# EAGLE design controller board 1.1 (EAGLE 7.6.0)
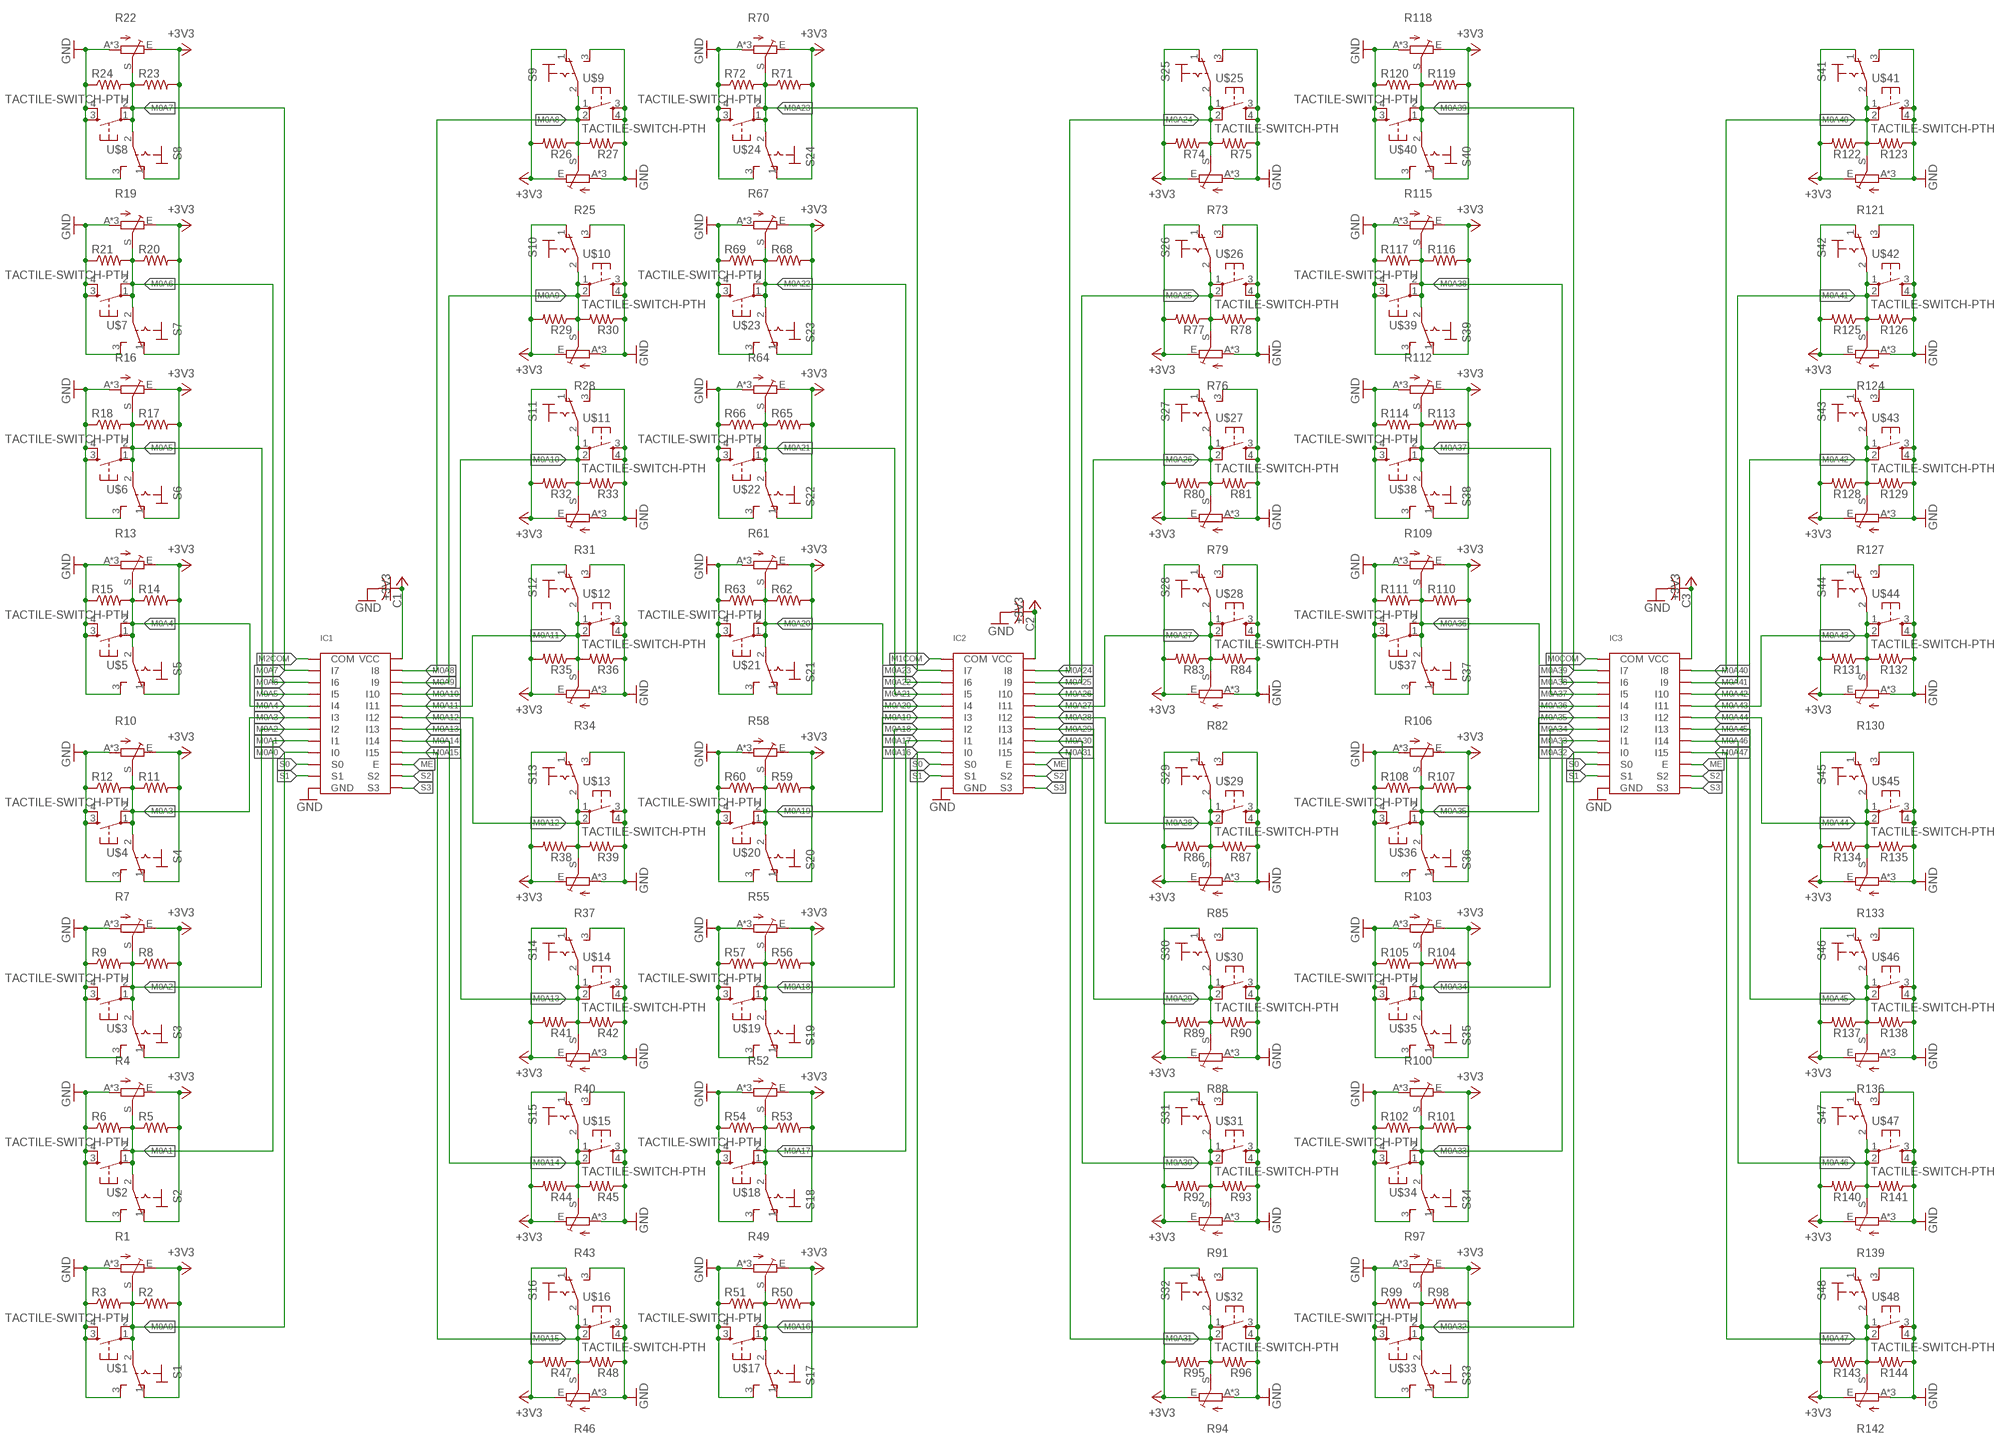
[diagram p0: schematic, sheet 1, part 1 of 2]
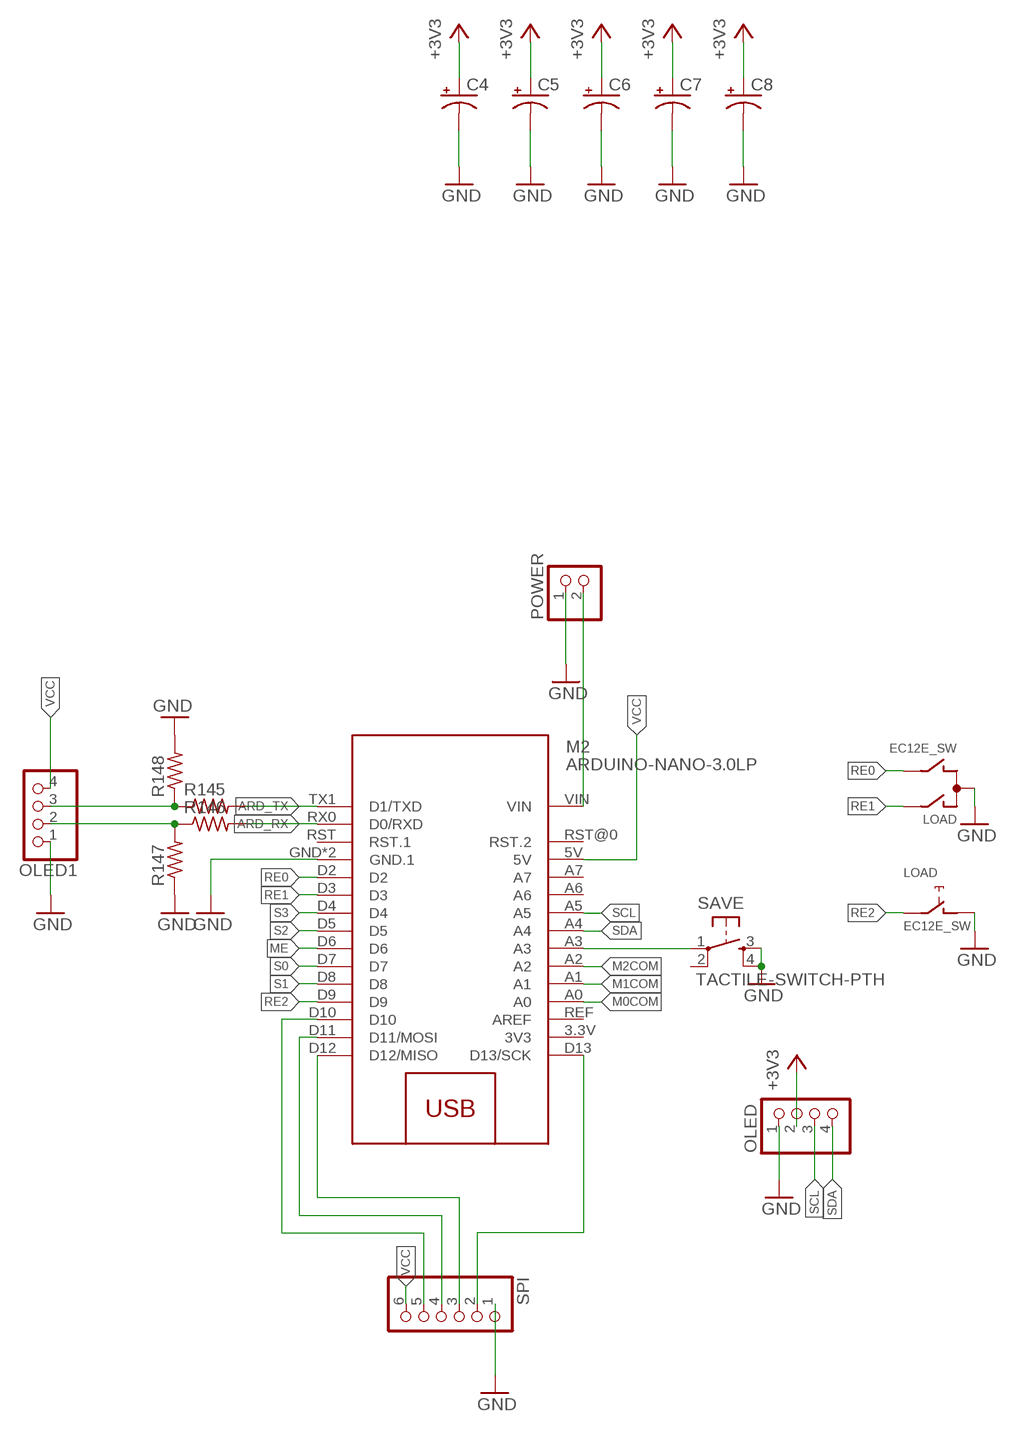
[diagram p1: schematic, sheet 1, part 2 of 2]

## Parts
C1  C-USC0805  [C0805]
C2  C-USC0805  [C0805]
C3  C-USC0805  [C0805]
C4  CPOL-USE2.5-6  [E2,5-6]
C5  CPOL-USE2.5-6  [E2,5-6]
C6  CPOL-USE2.5-6  [E2,5-6]
C7  CPOL-USE2.5-6  [E2,5-6]
C8  CPOL-USE2.5-6  [E2,5-6]
IC1  CD74HC4067SM96  [LP24SSOP]
IC2  CD74HC4067SM96  [LP24SSOP]
IC3  CD74HC4067SM96  [LP24SSOP]
LOAD  EC12E_SW  [ALPS_EC12E_SW]
M2  ARDUINO-NANO-3.0LP  [ARDUINO-NANO-3.0_LONGPADS]
OLED  PINHD-1X4  [1X04]
OLED1  PINHD-1X4  [1X04]
POWER  PINHD-1X2  [1X02]
R1  TDS3_TRIM_EU-RK09LS  [TDS3_RK09L]
R2  R-US_M0805  [M0805]
R3  R-US_M0805  [M0805]
R4  TDS3_TRIM_EU-RK09LS  [TDS3_RK09L]
R5  R-US_M0805  [M0805]
R6  R-US_M0805  [M0805]
R7  TDS3_TRIM_EU-RK09LS  [TDS3_RK09L]
R8  R-US_M0805  [M0805]
R9  R-US_M0805  [M0805]
R10  TDS3_TRIM_EU-RK09LS  [TDS3_RK09L]
R11  R-US_M0805  [M0805]
R12  R-US_M0805  [M0805]
R13  TDS3_TRIM_EU-RK09LS  [TDS3_RK09L]
R14  R-US_M0805  [M0805]
R15  R-US_M0805  [M0805]
R16  TDS3_TRIM_EU-RK09LS  [TDS3_RK09L]
R17  R-US_M0805  [M0805]
R18  R-US_M0805  [M0805]
R19  TDS3_TRIM_EU-RK09LS  [TDS3_RK09L]
R20  R-US_M0805  [M0805]
R21  R-US_M0805  [M0805]
R22  TDS3_TRIM_EU-RK09LS  [TDS3_RK09L]
R23  R-US_M0805  [M0805]
R24  R-US_M0805  [M0805]
R25  TDS3_TRIM_EU-RK09LS  [TDS3_RK09L]
R26  R-US_M0805  [M0805]
R27  R-US_M0805  [M0805]
R28  TDS3_TRIM_EU-RK09LS  [TDS3_RK09L]
R29  R-US_M0805  [M0805]
R30  R-US_M0805  [M0805]
R31  TDS3_TRIM_EU-RK09LS  [TDS3_RK09L]
R32  R-US_M0805  [M0805]
R33  R-US_M0805  [M0805]
R34  TDS3_TRIM_EU-RK09LS  [TDS3_RK09L]
R35  R-US_M0805  [M0805]
R36  R-US_M0805  [M0805]
R37  TDS3_TRIM_EU-RK09LS  [TDS3_RK09L]
R38  R-US_M0805  [M0805]
R39  R-US_M0805  [M0805]
R40  TDS3_TRIM_EU-RK09LS  [TDS3_RK09L]
R41  R-US_M0805  [M0805]
R42  R-US_M0805  [M0805]
R43  TDS3_TRIM_EU-RK09LS  [TDS3_RK09L]
R44  R-US_M0805  [M0805]
R45  R-US_M0805  [M0805]
R46  TDS3_TRIM_EU-RK09LS  [TDS3_RK09L]
R47  R-US_M0805  [M0805]
R48  R-US_M0805  [M0805]
R49  TDS3_TRIM_EU-RK09LS  [TDS3_RK09L]
R50  R-US_M0805  [M0805]
R51  R-US_M0805  [M0805]
R52  TDS3_TRIM_EU-RK09LS  [TDS3_RK09L]
R53  R-US_M0805  [M0805]
R54  R-US_M0805  [M0805]
R55  TDS3_TRIM_EU-RK09LS  [TDS3_RK09L]
R56  R-US_M0805  [M0805]
R57  R-US_M0805  [M0805]
R58  TDS3_TRIM_EU-RK09LS  [TDS3_RK09L]
R59  R-US_M0805  [M0805]
R60  R-US_M0805  [M0805]
R61  TDS3_TRIM_EU-RK09LS  [TDS3_RK09L]
R62  R-US_M0805  [M0805]
R63  R-US_M0805  [M0805]
R64  TDS3_TRIM_EU-RK09LS  [TDS3_RK09L]
R65  R-US_M0805  [M0805]
R66  R-US_M0805  [M0805]
R67  TDS3_TRIM_EU-RK09LS  [TDS3_RK09L]
R68  R-US_M0805  [M0805]
R69  R-US_M0805  [M0805]
R70  TDS3_TRIM_EU-RK09LS  [TDS3_RK09L]
R71  R-US_M0805  [M0805]
R72  R-US_M0805  [M0805]
R73  TDS3_TRIM_EU-RK09LS  [TDS3_RK09L]
R74  R-US_M0805  [M0805]
R75  R-US_M0805  [M0805]
R76  TDS3_TRIM_EU-RK09LS  [TDS3_RK09L]
R77  R-US_M0805  [M0805]
R78  R-US_M0805  [M0805]
R79  TDS3_TRIM_EU-RK09LS  [TDS3_RK09L]
R80  R-US_M0805  [M0805]
R81  R-US_M0805  [M0805]
R82  TDS3_TRIM_EU-RK09LS  [TDS3_RK09L]
R83  R-US_M0805  [M0805]
R84  R-US_M0805  [M0805]
R85  TDS3_TRIM_EU-RK09LS  [TDS3_RK09L]
R86  R-US_M0805  [M0805]
R87  R-US_M0805  [M0805]
R88  TDS3_TRIM_EU-RK09LS  [TDS3_RK09L]
R89  R-US_M0805  [M0805]
R90  R-US_M0805  [M0805]
R91  TDS3_TRIM_EU-RK09LS  [TDS3_RK09L]
R92  R-US_M0805  [M0805]
R93  R-US_M0805  [M0805]
R94  TDS3_TRIM_EU-RK09LS  [TDS3_RK09L]
R95  R-US_M0805  [M0805]
R96  R-US_M0805  [M0805]
R97  TDS3_TRIM_EU-RK09LS  [TDS3_RK09L]
R98  R-US_M0805  [M0805]
R99  R-US_M0805  [M0805]
R100  TDS3_TRIM_EU-RK09LS  [TDS3_RK09L]
R101  R-US_M0805  [M0805]
R102  R-US_M0805  [M0805]
R103  TDS3_TRIM_EU-RK09LS  [TDS3_RK09L]
R104  R-US_M0805  [M0805]
R105  R-US_M0805  [M0805]
R106  TDS3_TRIM_EU-RK09LS  [TDS3_RK09L]
R107  R-US_M0805  [M0805]
R108  R-US_M0805  [M0805]
R109  TDS3_TRIM_EU-RK09LS  [TDS3_RK09L]
R110  R-US_M0805  [M0805]
R111  R-US_M0805  [M0805]
R112  TDS3_TRIM_EU-RK09LS  [TDS3_RK09L]
R113  R-US_M0805  [M0805]
R114  R-US_M0805  [M0805]
R115  TDS3_TRIM_EU-RK09LS  [TDS3_RK09L]
R116  R-US_M0805  [M0805]
R117  R-US_M0805  [M0805]
R118  TDS3_TRIM_EU-RK09LS  [TDS3_RK09L]
R119  R-US_M0805  [M0805]
R120  R-US_M0805  [M0805]
R121  TDS3_TRIM_EU-RK09LS  [TDS3_RK09L]
R122  R-US_M0805  [M0805]
R123  R-US_M0805  [M0805]
R124  TDS3_TRIM_EU-RK09LS  [TDS3_RK09L]
R125  R-US_M0805  [M0805]
R126  R-US_M0805  [M0805]
R127  TDS3_TRIM_EU-RK09LS  [TDS3_RK09L]
R128  R-US_M0805  [M0805]
R129  R-US_M0805  [M0805]
R130  TDS3_TRIM_EU-RK09LS  [TDS3_RK09L]
R131  R-US_M0805  [M0805]
R132  R-US_M0805  [M0805]
R133  TDS3_TRIM_EU-RK09LS  [TDS3_RK09L]
R134  R-US_M0805  [M0805]
R135  R-US_M0805  [M0805]
R136  TDS3_TRIM_EU-RK09LS  [TDS3_RK09L]
R137  R-US_M0805  [M0805]
R138  R-US_M0805  [M0805]
R139  TDS3_TRIM_EU-RK09LS  [TDS3_RK09L]
R140  R-US_M0805  [M0805]
R141  R-US_M0805  [M0805]
R142  TDS3_TRIM_EU-RK09LS  [TDS3_RK09L]
R143  R-US_M0805  [M0805]
R144  R-US_M0805  [M0805]
R145  R-US_M0805  [M0805]
R146  R-US_M0805  [M0805]
R147  R-US_M0805  [M0805]
R148  R-US_M0805  [M0805]
S1  M9040P  [M9040P]
S2  M9040P  [M9040P]
S3  M9040P  [M9040P]
S4  M9040P  [M9040P]
S5  M9040P  [M9040P]
S6  M9040P  [M9040P]
S7  M9040P  [M9040P]
S8  M9040P  [M9040P]
S9  M9040P  [M9040P]
S10  M9040P  [M9040P]
S11  M9040P  [M9040P]
S12  M9040P  [M9040P]
S13  M9040P  [M9040P]
S14  M9040P  [M9040P]
S15  M9040P  [M9040P]
S16  M9040P  [M9040P]
S17  M9040P  [M9040P]
S18  M9040P  [M9040P]
S19  M9040P  [M9040P]
S20  M9040P  [M9040P]
S21  M9040P  [M9040P]
S22  M9040P  [M9040P]
S23  M9040P  [M9040P]
S24  M9040P  [M9040P]
S25  M9040P  [M9040P]
S26  M9040P  [M9040P]
S27  M9040P  [M9040P]
S28  M9040P  [M9040P]
S29  M9040P  [M9040P]
S30  M9040P  [M9040P]
S31  M9040P  [M9040P]
S32  M9040P  [M9040P]
S33  M9040P  [M9040P]
S34  M9040P  [M9040P]
S35  M9040P  [M9040P]
S36  M9040P  [M9040P]
S37  M9040P  [M9040P]
S38  M9040P  [M9040P]
S39  M9040P  [M9040P]
S40  M9040P  [M9040P]
S41  M9040P  [M9040P]
S42  M9040P  [M9040P]
S43  M9040P  [M9040P]
S44  M9040P  [M9040P]
S45  M9040P  [M9040P]
S46  M9040P  [M9040P]
S47  M9040P  [M9040P]
S48  M9040P  [M9040P]
SAVE  TACTILE-SWITCH-PTH  [TAC-SWITCH-PTH]
SPI  PINHD-1X6  [1X06]
U$1  TACTILE-SWITCH-PTH  [TAC-SWITCH-PTH]
U$2  TACTILE-SWITCH-PTH  [TAC-SWITCH-PTH]
U$3  TACTILE-SWITCH-PTH  [TAC-SWITCH-PTH]
U$4  TACTILE-SWITCH-PTH  [TAC-SWITCH-PTH]
U$5  TACTILE-SWITCH-PTH  [TAC-SWITCH-PTH]
U$6  TACTILE-SWITCH-PTH  [TAC-SWITCH-PTH]
U$7  TACTILE-SWITCH-PTH  [TAC-SWITCH-PTH]
U$8  TACTILE-SWITCH-PTH  [TAC-SWITCH-PTH]
U$9  TACTILE-SWITCH-PTH  [TAC-SWITCH-PTH]
U$10  TACTILE-SWITCH-PTH  [TAC-SWITCH-PTH]
U$11  TACTILE-SWITCH-PTH  [TAC-SWITCH-PTH]
U$12  TACTILE-SWITCH-PTH  [TAC-SWITCH-PTH]
U$13  TACTILE-SWITCH-PTH  [TAC-SWITCH-PTH]
U$14  TACTILE-SWITCH-PTH  [TAC-SWITCH-PTH]
U$15  TACTILE-SWITCH-PTH  [TAC-SWITCH-PTH]
U$16  TACTILE-SWITCH-PTH  [TAC-SWITCH-PTH]
U$17  TACTILE-SWITCH-PTH  [TAC-SWITCH-PTH]
U$18  TACTILE-SWITCH-PTH  [TAC-SWITCH-PTH]
U$19  TACTILE-SWITCH-PTH  [TAC-SWITCH-PTH]
U$20  TACTILE-SWITCH-PTH  [TAC-SWITCH-PTH]
U$21  TACTILE-SWITCH-PTH  [TAC-SWITCH-PTH]
U$22  TACTILE-SWITCH-PTH  [TAC-SWITCH-PTH]
U$23  TACTILE-SWITCH-PTH  [TAC-SWITCH-PTH]
U$24  TACTILE-SWITCH-PTH  [TAC-SWITCH-PTH]
U$25  TACTILE-SWITCH-PTH  [TAC-SWITCH-PTH]
U$26  TACTILE-SWITCH-PTH  [TAC-SWITCH-PTH]
U$27  TACTILE-SWITCH-PTH  [TAC-SWITCH-PTH]
U$28  TACTILE-SWITCH-PTH  [TAC-SWITCH-PTH]
U$29  TACTILE-SWITCH-PTH  [TAC-SWITCH-PTH]
U$30  TACTILE-SWITCH-PTH  [TAC-SWITCH-PTH]
U$31  TACTILE-SWITCH-PTH  [TAC-SWITCH-PTH]
U$32  TACTILE-SWITCH-PTH  [TAC-SWITCH-PTH]
U$33  TACTILE-SWITCH-PTH  [TAC-SWITCH-PTH]
U$34  TACTILE-SWITCH-PTH  [TAC-SWITCH-PTH]
U$35  TACTILE-SWITCH-PTH  [TAC-SWITCH-PTH]
U$36  TACTILE-SWITCH-PTH  [TAC-SWITCH-PTH]
U$37  TACTILE-SWITCH-PTH  [TAC-SWITCH-PTH]
U$38  TACTILE-SWITCH-PTH  [TAC-SWITCH-PTH]
U$39  TACTILE-SWITCH-PTH  [TAC-SWITCH-PTH]
U$40  TACTILE-SWITCH-PTH  [TAC-SWITCH-PTH]
U$41  TACTILE-SWITCH-PTH  [TAC-SWITCH-PTH]
U$42  TACTILE-SWITCH-PTH  [TAC-SWITCH-PTH]
U$43  TACTILE-SWITCH-PTH  [TAC-SWITCH-PTH]
U$44  TACTILE-SWITCH-PTH  [TAC-SWITCH-PTH]
U$45  TACTILE-SWITCH-PTH  [TAC-SWITCH-PTH]
U$46  TACTILE-SWITCH-PTH  [TAC-SWITCH-PTH]
U$47  TACTILE-SWITCH-PTH  [TAC-SWITCH-PTH]
U$48  TACTILE-SWITCH-PTH  [TAC-SWITCH-PTH]

## Nets
ARD_RX: M2.RX0(D0/RXD) R146.2
ARD_TX: M2.TX1(D1/TXD) R145.2
GND: C1.2 C2.2 C3.2 C4.- C5.- C6.- C7.- C8.- IC1.GND IC2.GND IC3.GND LOAD.C LOAD.D M2.GND(GND.1) M2.GND@1(GND.1) OLED1.1 OLED.1 POWER.1 R1.A R1.SNAPL(A) R1.SNAPR(A) R3.1 R4.A R4.SNAPL(A) R4.SNAPR(A) R6.1 R7.A R7.SNAPL(A) R7.SNAPR(A) R9.1 R10.A R10.SNAPL(A) R10.SNAPR(A) R12.1 R13.A R13.SNAPL(A) R13.SNAPR(A) R15.1 R16.A R16.SNAPL(A) R16.SNAPR(A) R18.1 R19.A R19.SNAPL(A) R19.SNAPR(A) R21.1 R22.A R22.SNAPL(A) R22.SNAPR(A) R24.1 R25.A R25.SNAPL(A) R25.SNAPR(A) R27.1 R28.A R28.SNAPL(A) R28.SNAPR(A) R30.1 R31.A R31.SNAPL(A) R31.SNAPR(A) R33.1 R34.A R34.SNAPL(A) R34.SNAPR(A) R36.1 R37.A R37.SNAPL(A) R37.SNAPR(A) R39.1 R40.A R40.SNAPL(A) R40.SNAPR(A) R42.1 R43.A R43.SNAPL(A) R43.SNAPR(A) R45.1 R46.A R46.SNAPL(A) R46.SNAPR(A) R48.1 R49.A R49.SNAPL(A) R49.SNAPR(A) R51.1 R52.A R52.SNAPL(A) R52.SNAPR(A) R54.1 R55.A R55.SNAPL(A) R55.SNAPR(A) R57.1 R58.A R58.SNAPL(A) R58.SNAPR(A) R60.1 R61.A R61.SNAPL(A) R61.SNAPR(A) R63.1 R64.A R64.SNAPL(A) R64.SNAPR(A) R66.1 R67.A R67.SNAPL(A) R67.SNAPR(A) R69.1 R70.A R70.SNAPL(A) R70.SNAPR(A) R72.1 R73.A R73.SNAPL(A) R73.SNAPR(A) R75.1 R76.A R76.SNAPL(A) R76.SNAPR(A) R78.1 R79.A R79.SNAPL(A) R79.SNAPR(A) R81.1 R82.A R82.SNAPL(A) R82.SNAPR(A) R84.1 R85.A R85.SNAPL(A) R85.SNAPR(A) R87.1 R88.A R88.SNAPL(A) R88.SNAPR(A) R90.1 R91.A R91.SNAPL(A) R91.SNAPR(A) R93.1 R94.A R94.SNAPL(A) R94.SNAPR(A) R96.1 R97.A R97.SNAPL(A) R97.SNAPR(A) R99.1 R100.A R100.SNAPL(A) R100.SNAPR(A) R102.1 R103.A R103.SNAPL(A) R103.SNAPR(A) R105.1 R106.A R106.SNAPL(A) R106.SNAPR(A) R108.1 R109.A R109.SNAPL(A) R109.SNAPR(A) R111.1 R112.A R112.SNAPL(A) R112.SNAPR(A) R114.1 R115.A R115.SNAPL(A) R115.SNAPR(A) R117.1 R118.A R118.SNAPL(A) R118.SNAPR(A) R120.1 R121.A R121.SNAPL(A) R121.SNAPR(A) R123.1 R124.A R124.SNAPL(A) R124.SNAPR(A) R126.1 R127.A R127.SNAPL(A) R127.SNAPR(A) R129.1 R130.A R130.SNAPL(A) R130.SNAPR(A) R132.1 R133.A R133.SNAPL(A) R133.SNAPR(A) R135.1 R136.A R136.SNAPL(A) R136.SNAPR(A) R138.1 R139.A R139.SNAPL(A) R139.SNAPR(A) R141.1 R142.A R142.SNAPL(A) R142.SNAPR(A) R144.1 R147.1 R148.2 S1.3(S) S2.3(S) S3.3(S) S4.3(S) S5.3(S) S6.3(S) S7.3(S) S8.3(S) S9.3(S) S10.3(S) S11.3(S) S12.3(S) S13.3(S) S14.3(S) S15.3(S) S16.3(S) S17.3(S) S18.3(S) S19.3(S) S20.3(S) S21.3(S) S22.3(S) S23.3(S) S24.3(S) S25.3(S) S26.3(S) S27.3(S) S28.3(S) S29.3(S) S30.3(S) S31.3(S) S32.3(S) S33.3(S) S34.3(S) S35.3(S) S36.3(S) S37.3(S) S38.3(S) S39.3(S) S40.3(S) S41.3(S) S42.3(S) S43.3(S) S44.3(S) S45.3(S) S46.3(S) S47.3(S) S48.3(S) SAVE.3 SAVE.4 SPI.1 U$1.3 U$1.4 U$2.3 U$2.4 U$3.3 U$3.4 U$4.3 U$4.4 U$5.3 U$5.4 U$6.3 U$6.4 U$7.3 U$7.4 U$8.3 U$8.4 U$9.3 U$9.4 U$10.3 U$10.4 U$11.3 U$11.4 U$12.3 U$12.4 U$13.3 U$13.4 U$14.3 U$14.4 U$15.3 U$15.4 U$16.3 U$16.4 U$17.3 U$17.4 U$18.3 U$18.4 U$19.3 U$19.4 U$20.3 U$20.4 U$21.3 U$21.4 U$22.3 U$22.4 U$23.3 U$23.4 U$24.3 U$24.4 U$25.3 U$25.4 U$26.3 U$26.4 U$27.3 U$27.4 U$28.3 U$28.4 U$29.3 U$29.4 U$30.3 U$30.4 U$31.3 U$31.4 U$32.3 U$32.4 U$33.3 U$33.4 U$34.3 U$34.4 U$35.3 U$35.4 U$36.3 U$36.4 U$37.3 U$37.4 U$38.3 U$38.4 U$39.3 U$39.4 U$40.3 U$40.4 U$41.3 U$41.4 U$42.3 U$42.4 U$43.3 U$43.4 U$44.3 U$44.4 U$45.3 U$45.4 U$46.3 U$46.4 U$47.3 U$47.4 U$48.3 U$48.4
M0A0: IC1.I0 R1.S R2.1 R3.2 S1.2(P) U$1.1 U$1.2
M0A1: IC1.I1 R4.S R5.1 R6.2 S2.2(P) U$2.1 U$2.2
M0A2: IC1.I2 R7.S R8.1 R9.2 S3.2(P) U$3.1 U$3.2
M0A3: IC1.I3 R10.S R11.1 R12.2 S4.2(P) U$4.1 U$4.2
M0A4: IC1.I4 R13.S R14.1 R15.2 S5.2(P) U$5.1 U$5.2
M0A5: IC1.I5 R16.S R17.1 R18.2 S6.2(P) U$6.1 U$6.2
M0A6: IC1.I6 R19.S R20.1 R21.2 S7.2(P) U$7.1 U$7.2
M0A7: IC1.I7 R22.S R23.1 R24.2 S8.2(P) U$8.1 U$8.2
M0A8: IC1.I8 R25.S R26.1 R27.2 S9.2(P) U$9.1 U$9.2
M0A9: IC1.I9 R28.S R29.1 R30.2 S10.2(P) U$10.1 U$10.2
M0A10: IC1.I10 R31.S R32.1 R33.2 S11.2(P) U$11.1 U$11.2
M0A11: IC1.I11 R34.S R35.1 R36.2 S12.2(P) U$12.1 U$12.2
M0A12: IC1.I12 R37.S R38.1 R39.2 S13.2(P) U$13.1 U$13.2
M0A13: IC1.I13 R40.S R41.1 R42.2 S14.2(P) U$14.1 U$14.2
M0A14: IC1.I14 R43.S R44.1 R45.2 S15.2(P) U$15.1 U$15.2
M0A15: IC1.I15 R46.S R47.1 R48.2 S16.2(P) U$16.1 U$16.2
M0A16: IC2.I0 R49.S R50.1 R51.2 S17.2(P) U$17.1 U$17.2
M0A17: IC2.I1 R52.S R53.1 R54.2 S18.2(P) U$18.1 U$18.2
M0A18: IC2.I2 R55.S R56.1 R57.2 S19.2(P) U$19.1 U$19.2
M0A19: IC2.I3 R58.S R59.1 R60.2 S20.2(P) U$20.1 U$20.2
M0A20: IC2.I4 R61.S R62.1 R63.2 S21.2(P) U$21.1 U$21.2
M0A21: IC2.I5 R64.S R65.1 R66.2 S22.2(P) U$22.1 U$22.2
M0A22: IC2.I6 R67.S R68.1 R69.2 S23.2(P) U$23.1 U$23.2
M0A23: IC2.I7 R70.S R71.1 R72.2 S24.2(P) U$24.1 U$24.2
M0A24: IC2.I8 R73.S R74.1 R75.2 S25.2(P) U$25.1 U$25.2
M0A25: IC2.I9 R76.S R77.1 R78.2 S26.2(P) U$26.1 U$26.2
M0A26: IC2.I10 R79.S R80.1 R81.2 S27.2(P) U$27.1 U$27.2
M0A27: IC2.I11 R82.S R83.1 R84.2 S28.2(P) U$28.1 U$28.2
M0A28: IC2.I12 R85.S R86.1 R87.2 S29.2(P) U$29.1 U$29.2
M0A29: IC2.I13 R88.S R89.1 R90.2 S30.2(P) U$30.1 U$30.2
M0A30: IC2.I14 R91.S R92.1 R93.2 S31.2(P) U$31.1 U$31.2
M0A31: IC2.I15 R94.S R95.1 R96.2 S32.2(P) U$32.1 U$32.2
M0A32: IC3.I0 R97.S R98.1 R99.2 S33.2(P) U$33.1 U$33.2
M0A33: IC3.I1 R100.S R101.1 R102.2 S34.2(P) U$34.1 U$34.2
M0A34: IC3.I2 R103.S R104.1 R105.2 S35.2(P) U$35.1 U$35.2
M0A35: IC3.I3 R106.S R107.1 R108.2 S36.2(P) U$36.1 U$36.2
M0A36: IC3.I4 R109.S R110.1 R111.2 S37.2(P) U$37.1 U$37.2
M0A37: IC3.I5 R112.S R113.1 R114.2 S38.2(P) U$38.1 U$38.2
M0A38: IC3.I6 R115.S R116.1 R117.2 S39.2(P) U$39.1 U$39.2
M0A39: IC3.I7 R118.S R119.1 R120.2 S40.2(P) U$40.1 U$40.2
M0A40: IC3.I8 R121.S R122.1 R123.2 S41.2(P) U$41.1 U$41.2
M0A41: IC3.I9 R124.S R125.1 R126.2 S42.2(P) U$42.1 U$42.2
M0A42: IC3.I10 R127.S R128.1 R129.2 S43.2(P) U$43.1 U$43.2
M0A43: IC3.I11 R130.S R131.1 R132.2 S44.2(P) U$44.1 U$44.2
M0A44: IC3.I12 R133.S R134.1 R135.2 S45.2(P) U$45.1 U$45.2
M0A45: IC3.I13 R136.S R137.1 R138.2 S46.2(P) U$46.1 U$46.2
M0A46: IC3.I14 R139.S R140.1 R141.2 S47.2(P) U$47.1 U$47.2
M0A47: IC3.I15 R142.S R143.1 R144.2 S48.2(P) U$48.1 U$48.2
M0COM: IC3.COM M2.A0
M1COM: IC2.COM M2.A1
M2COM: IC1.COM M2.A2
ME: IC1.E IC2.E IC3.E M2.D6
N$1: M2.D10 SPI.5
N$2: M2.D11(D11/MOSI) SPI.4
N$3: M2.D12(D12/MISO) SPI.3
N$4: M2.VIN POWER.2
N$5: M2.A3 SAVE.1
N$6: M2.D13(D13/SCK) SPI.2
N$7: OLED1.3 R145.1 R148.1
N$8: OLED1.2 R146.1 R147.2
RE0: LOAD.B M2.D2
RE1: LOAD.A M2.D3
RE2: LOAD.E M2.D9
S0: IC1.S0 IC2.S0 IC3.S0 M2.D7
S1: IC1.S1 IC2.S1 IC3.S1 M2.D8
S2: IC1.S2 IC2.S2 IC3.S2 M2.D5
S3: IC1.S3 IC2.S3 IC3.S3 M2.D4
SCL: M2.A5 OLED.3
SDA: M2.A4 OLED.4
VCC: C1.1 C2.1 C3.1 C4.+ C5.+ C6.+ C7.+ C8.+ IC1.VCC IC2.VCC IC3.VCC M2.5V OLED1.4 OLED.2 R1.E R2.2 R4.E R5.2 R7.E R8.2 R10.E R11.2 R13.E R14.2 R16.E R17.2 R19.E R20.2 R22.E R23.2 R25.E R26.2 R28.E R29.2 R31.E R32.2 R34.E R35.2 R37.E R38.2 R40.E R41.2 R43.E R44.2 R46.E R47.2 R49.E R50.2 R52.E R53.2 R55.E R56.2 R58.E R59.2 R61.E R62.2 R64.E R65.2 R67.E R68.2 R70.E R71.2 R73.E R74.2 R76.E R77.2 R79.E R80.2 R82.E R83.2 R85.E R86.2 R88.E R89.2 R91.E R92.2 R94.E R95.2 R97.E R98.2 R100.E R101.2 R103.E R104.2 R106.E R107.2 R109.E R110.2 R112.E R113.2 R115.E R116.2 R118.E R119.2 R121.E R122.2 R124.E R125.2 R127.E R128.2 R130.E R131.2 R133.E R134.2 R136.E R137.2 R139.E R140.2 R142.E R143.2 S1.1(O) S2.1(O) S3.1(O) S4.1(O) S5.1(O) S6.1(O) S7.1(O) S8.1(O) S9.1(O) S10.1(O) S11.1(O) S12.1(O) S13.1(O) S14.1(O) S15.1(O) S16.1(O) S17.1(O) S18.1(O) S19.1(O) S20.1(O) S21.1(O) S22.1(O) S23.1(O) S24.1(O) S25.1(O) S26.1(O) S27.1(O) S28.1(O) S29.1(O) S30.1(O) S31.1(O) S32.1(O) S33.1(O) S34.1(O) S35.1(O) S36.1(O) S37.1(O) S38.1(O) S39.1(O) S40.1(O) S41.1(O) S42.1(O) S43.1(O) S44.1(O) S45.1(O) S46.1(O) S47.1(O) S48.1(O) SPI.6 ; supply symbol labelled +3V3
Unconnected: LOAD.GND1(G) LOAD.GND2(G) M2.A6 M2.A7 M2.REF(AREF) M2.RST(RST.1) M2.RST@0(RST.2) SAVE.2

## Power pins joined to a net without a drawn wire
3V3: M2.3.3V(3V3)

## Library data of the parts
C1-C3 = adafruit:C-US: CAPACITOR, American symbol
C4-C8 = adafruit:CPOL-US: POLARIZED CAPACITOR, American symbol
IC1-IC3 = 001 - CD74HC4067 MUX_DEMUX:CD74HC4067: by miky_police Italy
LOAD = switch-alps:EC12E_SW: ALPS rotary Encoder EC12E series with switch; MPN: EC12E2424407; OC_FARNELL: 1520813; OC_NEWARK: 74M1068
M2 = diy-modules:ARDUINO-NANO-3.0: Arduino Nano 3.0
OLED OLED1 = pinhead:PINHD-1X4: PIN HEADER
POWER = pinhead:PINHD-1X2: PIN HEADER
R1 R4 R7 R10 R13 R16 R19 R22 R25 R28 R31 R34 R37 R40 R43 R46 R49 R52 R55 R58 R61 R64 R67 R70 R73 R76 R79 R82 R85 R88 R91 R94 R97 R100 R103 R106 R109 R112 R115 R118 R121 R124 R127 R130 R133 R136 R139 R142 = Synth Kit:TDS3_TRIM_EU-: POTENTIOMETER
R2 R3 R5 R6 R8 R9 R11 R12 R14 R15 R17 R18 R20 R21 R23 R24 R26 R27 R29 R30 R32 R33 R35 R36 R38 R39 R41 R42 R44 R45 R47 R48 R50 R51 R53 R54 R56 R57 R59 R60 R62 R63 R65 R66 R68 R69 R71 R72 R74 R75 R77 R78 R80 R81 R83 R84 R86 R87 R89 R90 R92 R93 R95 R96 R98 R99 R101 R102 R104 R105 R107 R108 R110 R111 R113 R114 R116 R117 R119 R120 R122 R123 R125 R126 R128 R129 R131 R132 R134 R135 R137 R138 R140 R141 R143-R148 = adafruit:R-US_: RESISTOR, American symbol
S1-S48 = switch:M9040P: TOGGLE SWITCH Marquardt
SAVE U$1-U$48 = GeekAmmo:TACTILE-SWITCH: Tactile Switch 4 Pins, SPST NO
SPI = pinhead:PINHD-1X6: PIN HEADER

## Board
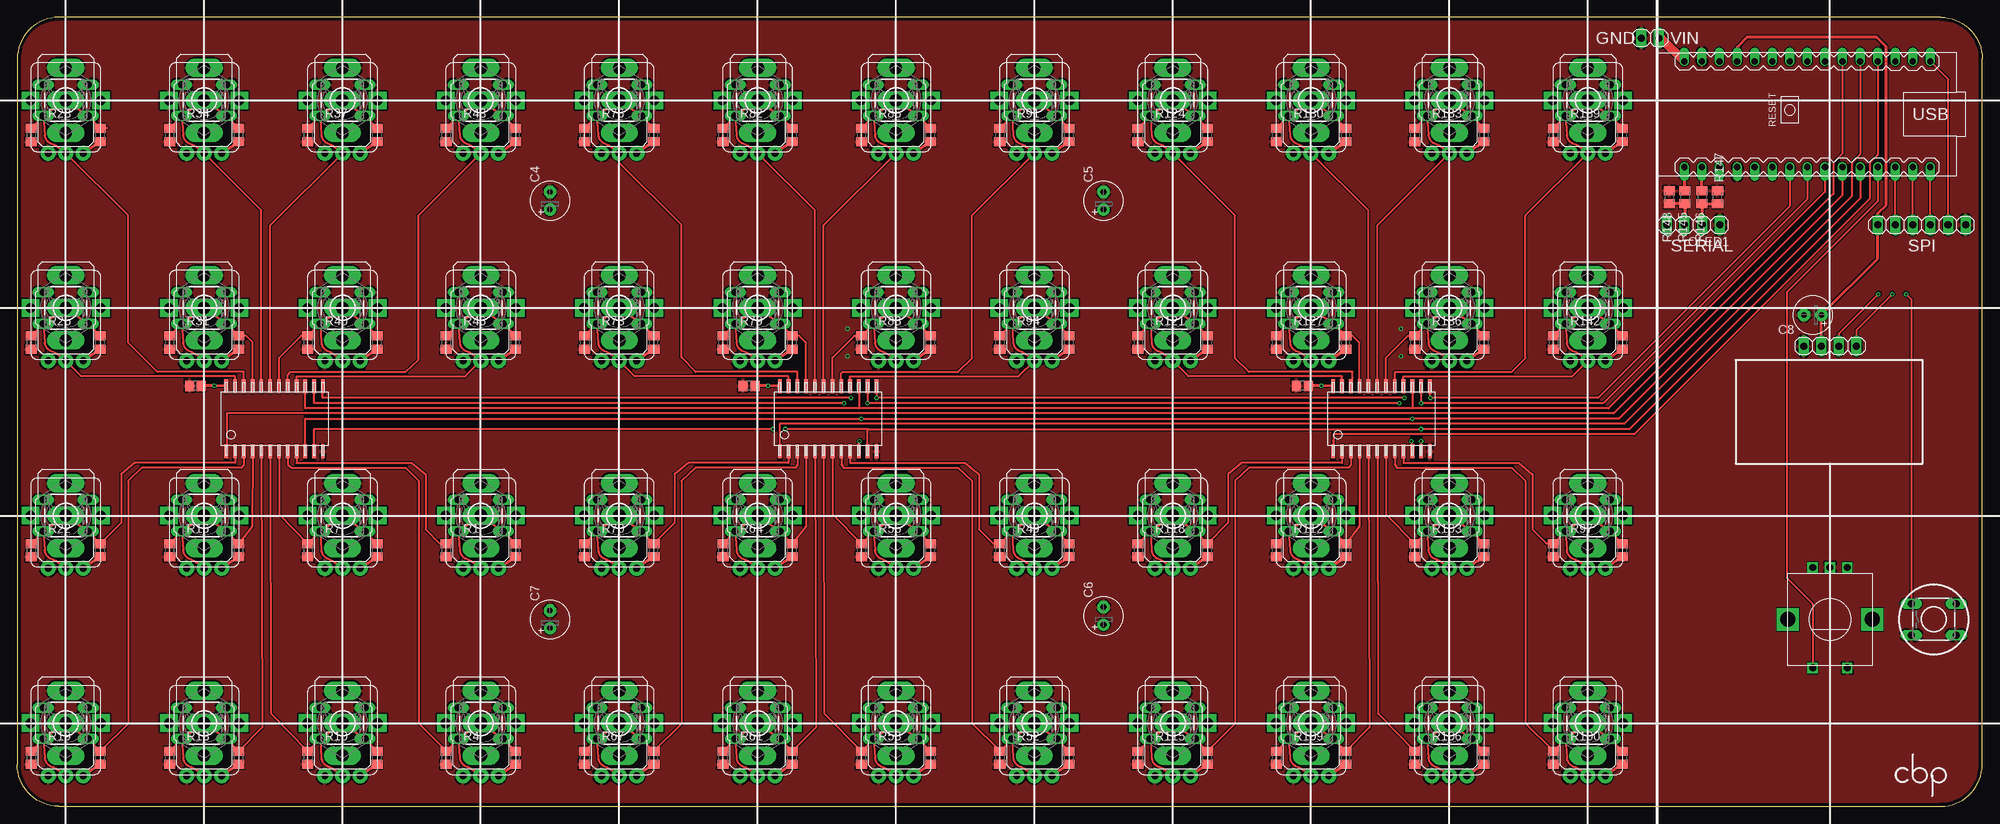
[diagram p2: board, top side]
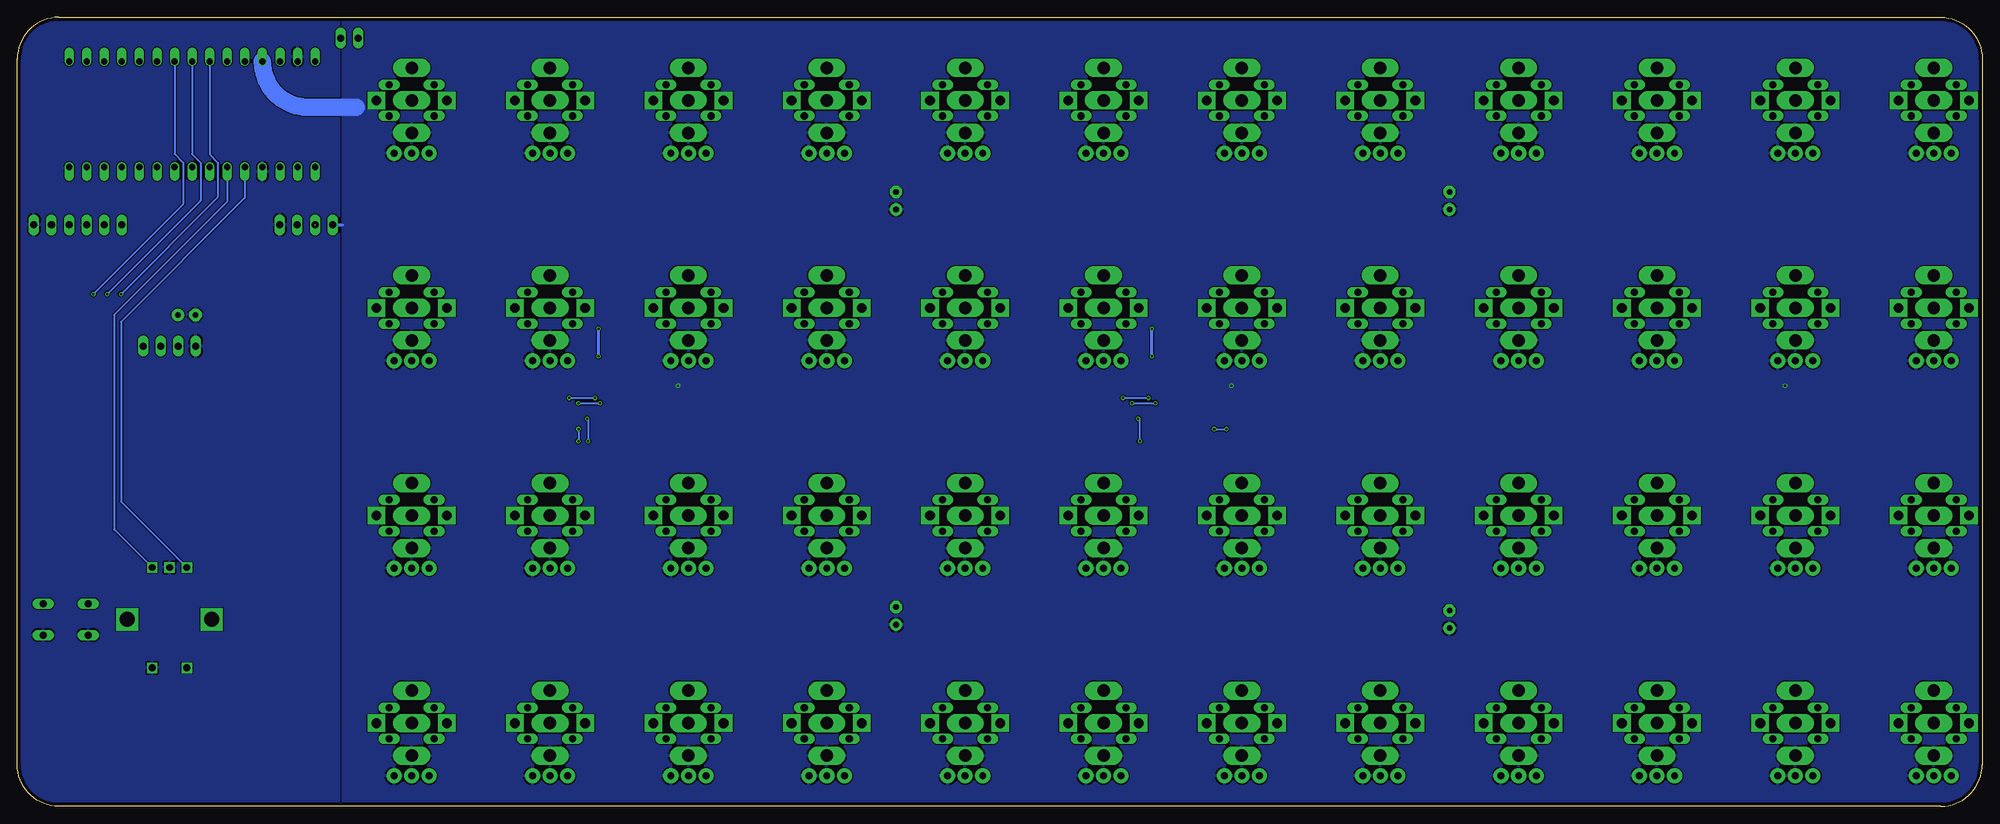
[diagram p3: board, bottom side, seen from below]

Size 284 x 114 mm. Coordinates in mm from the lower left corner, seen from the top.
Outline: 6,0 278,0 arc90 284,6 284,108 arc90 278,114 6,114 arc90 0,108 0,6 arc90 6,0
Copper layers (1*16): Top 0.035mm / dielectric 1.6mm / Bottom 0.035mm
Design rules "Elecrow_2-layer_PCB_eagle_rule": minimum track width 6mil, minimum drill 12mil, track to track 6mil, track to pad 6mil, pad to pad 6mil, via to via 8mil, smd to smd 0mil, copper to edge 20mil, drill to drill 10mil, minimum pad ring 6mil, minimum via ring 6mil, stop-mask expansion 0mil, vias tented up to drill 100mil, thermal gap 10mil

### Footprints (pad centres in the part's own frame; a part is rotated, then mirrored left to right if it is on the bottom)
C0805 = smd 1.3 x 1.5: 1 -0.85,0; 2 0.85,0
E2,5-6 = drill 0.813 pad 1.778: + -1.27,0 | drill 0.813 pad 1.778 octagon: - 1.27,0
LP24SSOP = smd 0.55 x 2: COM -6.8,-4.71; E 4.63,4.69; GND 7.17,-4.71; I0 3.36,-4.71; I1 2.09,-4.71; I2 0.82,-4.71; I3 -0.45,-4.71; I4 -1.72,-4.71; I5 -2.99,-4.71; I6 -4.26,-4.71; I7 -5.53,-4.71; I8 -5.53,4.69; I9 -4.26,4.69; I10 -2.99,4.69; I11 -1.72,4.69; I12 -0.45,4.69; I13 0.82,4.69; I14 2.09,4.69; I15 3.36,4.69; S0 4.63,-4.71; S1 5.9,-4.71; S2 5.9,4.69; S3 7.17,4.69; VCC -6.8,4.69
ALPS_EC12E_SW = drill 1 square: A -2.5,-7.5; B 2.5,-7.5; C 0,-7.5; D -2.5,7; E 2.5,7 | drill 2.2 square: GND1 -6.1,0; GND2 6.1,0
ARDUINO-NANO-3.0_LONGPADS = drill 0.9 offset: 3.3V -13.97,-7.62; 5V 11.43,-7.62; A0 -8.89,-7.62; A1 -6.35,-7.62; A2 -3.81,-7.62; A3 -1.27,-7.62; A4 1.27,-7.62; A5 3.81,-7.62; A6 6.35,-7.62; A7 8.89,-7.62; D2 8.89,7.62; D3 6.35,7.62; D4 3.81,7.62; D5 1.27,7.62; D6 -1.27,7.62; D7 -3.81,7.62; D8 -6.35,7.62; D9 -8.89,7.62; D10 -11.43,7.62; D11 -13.97,7.62; D12 -16.51,7.62; D13 -16.51,-7.62; GND 11.43,7.62; GND@1 16.51,-7.62; REF -11.43,-7.62; RST 13.97,7.62; RST@0 13.97,-7.62; RX0 16.51,7.62; TX1 19.05,7.62; VIN 19.05,-7.62
1X04 = drill 1.016 long: 1 -3.81,0; 2 -1.27,0; 3 1.27,0; 4 3.81,0
1X02 = drill 1.016 long: 1 -1.27,0; 2 1.27,0
TDS3_RK09L = drill 1 pad 2.184: A -2.54,-7.62; E 2.54,-7.62; S 0,-7.62 | drill 1.4 pad 2.54 square: SNAPL -5.08,0; SNAPR 5.08,0
M0805 = smd 1.3 x 1.6: 1 -0.95,0; 2 0.95,0
M9040P = drill 1.803 pad 2.184 long: 1 0,4.699; 2 0,0; 3 0,-4.699
TAC-SWITCH-PTH = drill 1.016 pad 1.524 long: 1 -3.251,2.261; 2 3.251,2.261; 3 -3.251,-2.261; 4 3.251,-2.261
1X06 = drill 1.016 long: 1 -6.35,0; 2 -3.81,0; 3 -1.27,0; 4 1.27,0; 5 3.81,0; 6 6.35,0

### Placement (x,y rotation side)
C1  25.75,60.75 180 top
C2  105.75,60.75 180 top
C3  185.75,60.75 180 top
C4  77,87.5 90 top
C5  157,87.5 90 top
C6  157,27.5 90 top
C7  77,27 90 top
C8  259.5,71 180 top
IC1  37,56 0 top
IC2  117,56 0 top
IC3  197,56 0 top
LOAD  262,27 180 top
M2  260,100 180 top
OLED  262,66.5 0 top
OLED1  242.25,84 180 top
POWER  236,111 0 top
R1  67,42 0 top
R2  72,37 270 top
R3  62,37 90 top
R4  67,12 0 top
R5  72,7 270 top
R6  62,7 90 top
R7  47,42 0 top
R8  52,37 270 top
R9  42,37 90 top
R10  47,12 0 top
R11  52,7 270 top
R12  42,7 90 top
R13  27,12 0 top
R14  32,7 270 top
R15  22,7 90 top
R16  27,42 0 top
R17  32,37 270 top
R18  22,37 90 top
R19  7,12 0 top
R20  12,7 270 top
R21  2,7 90 top
R22  7,42 0 top
R23  12,37 270 top
R24  2,37 90 top
R25  7,72 0 top
R26  12,67 270 top
R27  2,67 90 top
R28  7,102 0 top
R29  12,97 270 top
R30  2,97 90 top
R31  27,72 0 top
R32  32,67 270 top
R33  22,67 90 top
R34  27,102 0 top
R35  32,97 270 top
R36  22,97 90 top
R37  47,102 0 top
R38  52,97 270 top
R39  42,97 90 top
R40  47,72 0 top
R41  52,67 270 top
R42  42,67 90 top
R43  67,102 0 top
R44  72,97 270 top
R45  62,97 90 top
R46  67,72 0 top
R47  72,67 270 top
R48  62,67 90 top
R49  147,42 0 top
R50  152,37 270 top
R51  142,37 90 top
R52  147,12 0 top
R53  152,7 270 top
R54  142,7 90 top
R55  127,42 0 top
R56  132,37 270 top
R57  122,37 90 top
R58  127,12 0 top
R59  132,7 270 top
R60  122,7 90 top
R61  107,12 0 top
R62  112,7 270 top
R63  102,7 90 top
R64  107,42 0 top
R65  112,37 270 top
R66  102,37 90 top
R67  87,12 0 top
R68  92,7 270 top
R69  82,7 90 top
R70  87,42 0 top
R71  92,37 270 top
R72  82,37 90 top
R73  87,72 0 top
R74  92,67 270 top
R75  82,67 90 top
R76  87,102 0 top
R77  92,97 270 top
R78  82,97 90 top
R79  107,72 0 top
R80  112,67 270 top
R81  102,67 90 top
R82  107,102 0 top
R83  112,97 270 top
R84  102,97 90 top
R85  127,102 0 top
R86  132,97 270 top
R87  122,97 90 top
R88  127,72 0 top
R89  132,67 270 top
R90  122,67 90 top
R91  147,102 0 top
R92  152,97 270 top
R93  142,97 90 top
R94  147,72 0 top
R95  152,67 270 top
R96  142,67 90 top
R97  227,42 0 top
R98  232,37 270 top
R99  222,37 90 top
R100  227,12 0 top
R101  232,7 270 top
R102  222,7 90 top
R103  207,42 0 top
R104  212,37 270 top
R105  202,37 90 top
R106  207,12 0 top
R107  212,7 270 top
R108  202,7 90 top
R109  187,12 0 top
R110  192,7 270 top
R111  182,7 90 top
R112  187,42 0 top
R113  192,37 270 top
R114  182,37 90 top
R115  167,12 0 top
R116  172,7 270 top
R117  162,7 90 top
R118  167,42 0 top
R119  172,37 270 top
R120  162,37 90 top
R121  167,72 0 top
R122  172,67 270 top
R123  162,67 90 top
R124  167,102 0 top
R125  172,97 270 top
R126  162,97 90 top
R127  187,72 0 top
R128  192,67 270 top
R129  182,67 90 top
R130  187,102 0 top
R131  192,97 270 top
R132  182,97 90 top
R133  207,102 0 top
R134  212,97 270 top
R135  202,97 90 top
R136  207,72 0 top
R137  212,67 270 top
R138  202,67 90 top
R139  227,102 0 top
R140  232,97 270 top
R141  222,97 90 top
R142  227,72 0 top
R143  232,67 270 top
R144  222,67 90 top
R145  241,88 90 top
R146  243.5,88 90 top
R147  245.75,88 270 top
R148  238.75,88 90 top
S1  67,42 180 top
S2  67,12 180 top
S3  47,42 180 top
S4  47,12 180 top
S5  27,12 180 top
S6  27,42 180 top
S7  7,12 180 top
S8  7,42 180 top
S9  7,72 180 top
S10  7,102 180 top
S11  27,72 180 top
S12  27,102 180 top
S13  47,102 180 top
S14  47,72 180 top
S15  67,102 180 top
S16  67,72 180 top
S17  147,42 180 top
S18  147,12 180 top
S19  127,42 180 top
S20  127,12 180 top
S21  107,12 180 top
S22  107,42 180 top
S23  87,12 180 top
S24  87,42 180 top
S25  87,72 180 top
S26  87,102 180 top
S27  107,72 180 top
S28  107,102 180 top
S29  127,102 180 top
S30  127,72 180 top
S31  147,102 180 top
S32  147,72 180 top
S33  227,42 180 top
S34  227,12 180 top
S35  207,42 180 top
S36  207,12 180 top
S37  187,12 180 top
S38  187,42 180 top
S39  167,12 180 top
S40  167,42 180 top
S41  167,72 180 top
S42  167,102 180 top
S43  187,72 180 top
S44  187,102 180 top
S45  207,102 180 top
S46  207,72 180 top
S47  227,102 180 top
S48  227,72 180 top
SAVE  277,27 0 top
SPI  275.25,84 180 top
U$1  67,42 180 top
U$2  67,12 180 top
U$3  47,42 180 top
U$4  47,12 180 top
U$5  27,12 180 top
U$6  27,42 180 top
U$7  7,12 180 top
U$8  7,42 180 top
U$9  7,72 180 top
U$10  7,102 180 top
U$11  27,72 180 top
U$12  27,102 180 top
U$13  47,102 180 top
U$14  47,72 180 top
U$15  67,102 180 top
U$16  67,72 180 top
U$17  147,42 180 top
U$18  147,12 180 top
U$19  127,42 180 top
U$20  127,12 180 top
U$21  107,12 180 top
U$22  107,42 180 top
U$23  87,12 180 top
U$24  87,42 180 top
U$25  87,72 180 top
U$26  87,102 180 top
U$27  107,72 180 top
U$28  107,102 180 top
U$29  127,102 180 top
U$30  127,72 180 top
U$31  147,102 180 top
U$32  147,72 180 top
U$33  227,42 180 top
U$34  227,12 180 top
U$35  207,42 180 top
U$36  207,12 180 top
U$37  187,12 180 top
U$38  187,42 180 top
U$39  167,12 180 top
U$40  167,42 180 top
U$41  167,72 180 top
U$42  167,102 180 top
U$43  187,72 180 top
U$44  187,102 180 top
U$45  207,102 180 top
U$46  207,72 180 top
U$47  227,102 180 top
U$48  227,72 180 top

### Tracks (layer width: path | path; a pad name or v marks a point on that pad's centre or on a via)
ARD_RX
  Top 0.406: R146.2 M2.RX0
ARD_TX
  Top 0.406: R145.2 241,92.33 M2.TX1
GND  (via drill 0.3)
  Bottom 0.406: v120,65 v120,69 | v200,65 v200,69
  pour Top: -3,-6 -3,117 287,117 287,-3 0,-3 0,-6
  pour Bottom (rank 2): 237,-3 287,-3 287,117 237,117
M0A0
  Top 0.305: U$1.2 R3.2 61.95,38 61,38 59,40 59,48 57,49.62 40.37,49.62 40.37,52.1 IC1.I0 | U$1.2 S1.2 U$1.1 R2.1 | U$1.2 63.95,36.99 arc62 64.79,35.81 arc-25 R1.S
M0A1
  Top 0.305: U$2.2 R6.2 61.95,8 62,8 58,12 58,47 56.12,48.88 39.65,48.88 39.11,49.36 IC1.I1 | U$2.2 S2.2 U$2.1 R5.1 | U$2.2 63.95,6.99 arc62 64.79,5.81 arc-25 R4.S
M0A2
  Top 0.305: U$3.2 R9.2 37.82,42.22 IC1.I2 | U$3.2 S3.2 U$3.1 R8.1 | U$3.2 43.95,36.99 arc62 44.79,35.81 arc-25 R7.S
M0A3
  Top 0.305: U$4.2 R12.2 36.63,13.4 IC1.I3 | U$4.2 S4.2 U$4.1 R11.1 | U$4.2 43.95,6.99 arc62 44.79,5.81 arc-25 R10.S
M0A4
  Top 0.305: R15.2 U$5.2 | U$5.2 S5.2 U$5.1 R14.1 35.43,11.39 IC1.I4 | U$5.2 23.95,6.99 arc62 24.79,5.81 arc-25 R13.S
M0A5
  Top 0.305: R18.2 U$6.2 | U$6.2 S6.2 U$6.1 R17.1 33.97,40.44 IC1.I5 | U$6.2 23.95,36.99 arc62 24.79,35.81 arc-25 R16.S
M0A6
  Top 0.305: R21.2 U$7.2 | U$7.2 S7.2 U$7.1 R20.1 16,11.95 16,47 18,48.88 32.38,48.88 32.74,49.36 IC1.I6 | U$7.2 3.95,6.99 arc62 4.79,5.81 arc-25 R19.S
M0A7
  Top 0.305: R24.2 U$8.2 | U$8.2 S8.2 U$8.1 R23.1 15,40.95 15,48 17,49.62 31.47,49.62 31.43,51.79 IC1.I7 | U$8.2 3.95,36.99 arc62 4.79,35.81 arc-25 R22.S
M0A8
  Top 0.305: U$9.2 R27.2 2,68 | U$9.2 S9.2 U$9.1 R26.1 | U$9.2 3.95,66.99 arc62 4.79,65.81 arc-25 R25.S 9.26,62.12 31.47,62.12 IC1.I8
M0A9
  Top 0.305: R30.2 U$10.2 | U$10.2 S10.2 U$10.1 R29.1 12.05,98 13,98 | U$10.2 3.95,96.99 arc62 4.79,95.81 arc-25 R28.S 16,85.38 16,67 20.25,62.75 32.75,62.75 32.75,61.95 IC1.I9
M0A10
  Top 0.305: R33.2 U$11.2 | U$11.2 S11.2 U$11.1 R32.1 33.1,67.95 34.01,67.04 IC1.I10 | U$11.2 23.95,66.99 arc62 24.79,65.81 arc-25 R31.S
M0A11
  Top 0.305: R36.2 U$12.2 | U$12.2 S12.2 U$12.1 R35.1 32.05,98 | U$12.2 23.95,96.99 arc62 24.79,95.81 arc-25 R34.S 35.28,86.1 IC1.I11
M0A12
  Top 0.305: U$13.2 43.95,96.99 arc62 44.79,95.81 arc-25 R37.S 36.55,83.93 IC1.I12 | U$13.2 S13.2 U$13.1 | U$13.1 49.44,99.74 | R38.1 52,97.99 U$13.1 | U$13.2 43.75,99.7 R39.2 41.95,98
M0A13
  Top 0.305: U$14.2 R42.2 41.95,68 41,68 37.82,64.82 IC1.I13 | U$14.2 S14.2 U$14.1 R41.1 | U$14.2 43.95,66.99 arc62 44.79,65.81 arc-25 R40.S
M0A14
  Top 0.305: U$15.2 R45.2 61.95,98 | U$15.2 S15.2 U$15.1 R44.1 | U$15.2 63.95,96.99 arc62 64.79,95.81 arc-25 R43.S 58,85.38 58,64.5 56.12,62.75 39.5,62.75 39.09,62.28 IC1.I14
M0A15
  Top 0.305: U$16.2 R48.2 61.95,68 | U$16.2 S16.2 U$16.1 R47.1 | U$16.2 63.95,66.99 arc62 64.79,65.81 arc-25 R46.S 64.75,62.12 40.36,62.12 IC1.I15
M0A16
  Top 0.305: U$17.2 R51.2 141.95,38 141,38 139,40 139,48 137,49.62 120.37,49.62 120.37,52.1 IC2.I0 | U$17.2 S17.2 U$17.1 R50.1 | U$17.2 143.95,36.99 arc62 144.79,35.81 arc-25 R49.S
M0A17
  Top 0.305: U$18.2 R54.2 141.95,8 142,8 138,12 138,47 136,48.88 119.4,48.88 119.11,49.36 IC2.I1 | U$18.2 S18.2 U$18.1 R53.1 | U$18.2 143.95,6.99 arc62 144.79,5.81 arc-25 R52.S
M0A18
  Top 0.305: U$19.2 R57.2 117.82,42.22 IC2.I2 | U$19.2 S19.2 U$19.1 R56.1 | U$19.2 123.95,36.99 arc62 124.79,35.81 arc-25 R55.S
M0A19
  Top 0.305: U$20.2 R60.2 116.63,13.4 IC2.I3 | U$20.2 S20.2 U$20.1 R59.1 | U$20.2 123.95,6.99 arc62 124.79,5.81 arc-25 R58.S
M0A20
  Top 0.305: R63.2 U$21.2 | U$21.2 S21.2 U$21.1 R62.1 115.43,11.39 IC2.I4 | U$21.2 103.95,6.99 arc62 104.79,5.81 arc-25 R61.S
M0A21
  Top 0.305: R66.2 U$22.2 | U$22.2 S22.2 U$22.1 R65.1 113.97,40.44 IC2.I5 | U$22.2 103.95,36.99 arc62 104.79,35.81 arc-25 R64.S
M0A22
  Top 0.305: R69.2 U$23.2 | U$23.2 S23.2 U$23.1 R68.1 96,11.95 96,47 98,48.88 112.38,48.88 112.74,49.36 IC2.I6 | U$23.2 83.95,6.99 arc62 84.79,5.81 arc-25 R67.S
M0A23
  Top 0.305: R72.2 U$24.2 | U$24.2 S24.2 U$24.1 R71.1 95,40.95 95,48 97,49.62 111.47,49.62 111.43,51.79 IC2.I7 | U$24.2 83.95,36.99 arc62 84.79,35.81 arc-25 R70.S
M0A24
  Top 0.305: U$25.2 R75.2 82,68 | U$25.2 S25.2 U$25.1 R74.1 92.05,68 | U$25.2 83.95,66.99 arc62 84.79,65.81 arc-25 R73.S 89.25,62.12 111.47,62.12 IC2.I8
M0A25
  Top 0.305: R78.2 U$26.2 | U$26.2 S26.2 U$26.1 R77.1 | U$26.2 83.95,96.99 arc62 84.79,95.81 arc-25 R76.S 87,93 96,84 96,64.88 98,62.75 112.75,62.75 112.75,61.95 IC2.I9
M0A26
  Top 0.305: R81.2 U$27.2 | U$27.2 S27.2 U$27.1 R80.1 112.05,68 113,68 114.01,66.99 IC2.I10 | U$27.2 103.95,66.99 arc62 104.79,65.81 arc-25 R79.S
M0A27
  Top 0.305: R84.2 U$28.2 | U$28.2 S28.2 U$28.1 R83.1 | U$28.2 103.95,96.99 arc62 104.79,95.81 arc-25 R82.S 115.28,86.1 IC2.I11
M0A28
  Top 0.305: U$29.2 123.95,96.99 arc62 124.79,95.81 arc-25 R85.S 116.55,83.93 IC2.I12 | U$29.2 S29.2 U$29.1 | U$29.1 129.44,99.74 | R86.1 132,97.99 U$29.1 | U$29.2 123.75,99.7 R87.2
M0A29
  Top 0.305: U$30.2 R90.2 121.95,68 121,68 117.82,64.82 IC2.I13 | U$30.2 S30.2 U$30.1 R89.1 | U$30.2 123.95,66.99 arc62 124.79,65.81 arc-25 R88.S
M0A30
  Top 0.305: R93.2 U$31.2 | U$31.2 S31.2 U$31.1 R92.1 | U$31.2 143.95,96.99 arc62 144.79,95.81 arc-25 R91.S 138,85.38 138,64.75 136,62.75 119.25,62.75 119.09,62.53 IC2.I14
M0A31
  Top 0.305: R96.2 U$32.2 | U$32.2 S32.2 U$32.1 R95.1 | U$32.2 143.95,66.99 arc62 144.79,65.81 arc-25 R94.S 144.75,62.12 120.36,62.12 IC2.I15
M0A32
  Top 0.305: U$33.2 R99.2 221.95,38 221,38 219,40 219,48 217,49.62 200.37,49.62 200.37,52.1 IC3.I0 | U$33.2 S33.2 U$33.1 R98.1 | U$33.2 223.95,36.99 arc62 224.79,35.81 arc-25 R97.S
M0A33
  Top 0.305: U$34.2 R102.2 221.95,8 222,8 218,12 218,47 216,48.88 199.4,48.88 199.11,49.36 IC3.I1 | U$34.2 S34.2 U$34.1 R101.1 | U$34.2 223.95,6.99 arc62 224.79,5.81 arc-25 R100.S
M0A34
  Top 0.305: U$35.2 R105.2 197.82,42.22 IC3.I2 | U$35.2 S35.2 U$35.1 R104.1 | U$35.2 203.95,36.99 arc62 204.79,35.81 arc-25 R103.S
M0A35
  Top 0.305: U$36.2 R108.2 196.63,13.4 IC3.I3 | U$36.2 S36.2 U$36.1 R107.1 | U$36.2 203.95,6.99 arc62 204.79,5.81 arc-25 R106.S
M0A36
  Top 0.305: R111.2 U$37.2 | U$37.2 S37.2 U$37.1 R110.1 195.43,11.39 IC3.I4 | U$37.2 183.95,6.99 arc62 184.79,5.81 arc-25 R109.S
M0A37
  Top 0.305: R114.2 U$38.2 | U$38.2 S38.2 U$38.1 R113.1 193.97,40.44 IC3.I5 | U$38.2 183.95,36.99 arc62 184.79,35.81 arc-25 R112.S
M0A38
  Top 0.305: R117.2 U$39.2 | U$39.2 S39.2 U$39.1 R116.1 176,11.95 176,47 178,48.88 192.38,48.88 192.74,49.36 IC3.I6 | U$39.2 163.95,6.99 arc62 164.79,5.81 arc-25 R115.S
M0A39
  Top 0.305: R120.2 U$40.2 | U$40.2 S40.2 U$40.1 R119.1 175,40.95 175,48 177,49.62 191.47,49.62 191.43,51.79 IC3.I7 | U$40.2 163.95,36.99 arc62 164.79,35.81 arc-25 R118.S
M0A40
  Top 0.305: U$41.2 R123.2 162,68 | U$41.2 S41.2 U$41.1 R122.1 | U$41.2 163.95,66.99 arc62 164.79,65.81 arc-25 R121.S 169.25,62.12 191.47,62.12 IC3.I8
M0A41
  Top 0.305: R126.2 U$42.2 | U$42.2 S42.2 U$42.1 R125.1 | U$42.2 163.95,96.99 arc62 164.79,95.81 arc-25 R124.S 176,85.38 176,64.75 178,62.75 193,62.75 193,61.95 IC3.I9
M0A42
  Top 0.305: R129.2 U$43.2 | U$43.2 S43.2 U$43.1 R128.1 192.05,68 193,68 194.01,66.99 IC3.I10 | U$43.2 183.95,66.99 arc62 184.79,65.81 arc-25 R127.S
M0A43
  Top 0.305: R132.2 U$44.2 | U$44.2 S44.2 U$44.1 R131.1 | U$44.2 183.95,96.99 arc62 184.79,95.81 arc-25 R130.S 195.28,86.1 IC3.I11
M0A44
  Top 0.305: U$45.2 203.95,96.99 arc62 204.79,95.81 arc-25 R133.S 196.55,83.93 IC3.I12 | U$45.2 S45.2 U$45.1 | U$45.1 209.44,99.74 | R134.1 212,97.99 U$45.1 | U$45.2 203.75,99.7 R135.2
M0A45
  Top 0.305: U$46.2 R138.2 201.95,68 201,68 197.82,64.82 IC3.I13 | U$46.2 S46.2 U$46.1 R137.1 | U$46.2 203.95,66.99 arc62 204.79,65.81 arc-25 R136.S
M0A46
  Top 0.305: R141.2 U$47.2 | U$47.2 S47.2 U$47.1 R140.1 | U$47.2 223.95,96.99 arc62 224.79,95.81 arc-25 R139.S 218,85.38 218,64.75 216,62.75 199.25,62.75 199.09,62.66 IC3.I14
M0A47
  Top 0.305: R144.2 U$48.2 | U$48.2 S48.2 U$48.1 R143.1 | U$48.2 223.95,66.99 arc62 224.79,65.81 arc-25 R142.S 224.75,62.12 200.36,62.12 IC3.I15
M0COM
  Top 0.305: M2.A0 268.89,94.14 267.75,93 267.75,87.75 233.75,53.75 190.25,53.75 190.25,52.75 190.2,52.75 IC3.COM
M1COM
  Top 0.305: M2.A1 266.35,94.22 265.12,93 265.12,88.12 232.25,55.25 110.2,55.25 IC2.COM
M2COM
  Top 0.305: M2.A2 263.81,94.31 262.5,93 262.5,88.5 230.75,56.75 30.25,56.75 30.25,51.34 IC1.COM
ME
  Top 0.305: M2.D6 261.27,88.77 230,57.5 201.63,57.5 | IC3.E 201.63,57.5 | 201.63,57.5 121.63,57.5 | IC2.E 121.63,57.5 | 121.63,57.5 41.63,57.5 IC1.E
N$1
  Top 0.305: SPI.5 M2.D10
N$2
  Top 0.305: SPI.4 M2.D11
N$3
  Top 0.305: SPI.3 M2.D12
N$4
  Top 1.27: POWER.2 237.57,111 M2.VIN
N$5  (via drill 0.3)
  Top 0.305: v273,74 273.75,73.25 SAVE.1
  Bottom 0.305: M2.A3 261.27,94.27 260,93 260,87 v273,74
N$6
  Top 0.305: SPI.2 279.06,105.07 M2.D13
N$7  (1 unrouted)
  Top 0.406: 241,84.04 R145.1 R148.1
N$8
  Top 0.406: OLED1.2 243.52,87.03 R146.1 R147.2
RE0
  Bottom 0.305: M2.D2 251.11,87.89 269,70 269,44 LOAD.B
RE1
  Bottom 0.305: M2.D3 253.65,87.35 270,71 270,40 LOAD.A
RE2
  Top 0.305: M2.D9 268.89,87.39 255.75,74.25 255.75,33 259.5,29.25 LOAD.E
S0  (via drill 0.3)
  Top 0.305: M2.D7 263.81,88.31 231.5,56 v201.63,56 v122,56 41.63,56 IC1.S0 | v201.5,52.75 IC3.S0 | IC2.S0 121.63,52.63 v121.75,52.75
  Bottom 0.305: v201.63,56 201.5,55.87 v201.5,52.75 | v121.75,52.75 121.75,55.75 v122,56
S1  (via drill 0.3)
  Top 0.305: M2.D8 266.35,87.85 233,54.5 v202.9,54.5 123,54.5 | v202.9,52.75 IC3.S1 | IC1.S1 42.9,54.5 v109.25,54.5 | IC2.S1 122.9,54.4 123,54.5 | 123,54.5 v111,54.5
  Bottom 0.305: v202.9,54.5 v202.9,52.75 | v111,54.5 v109.25,54.5
S2  (via drill 0.3)
  Top 0.305: 203,60.59 IC3.S2 v202.9,58.25 229.25,58.25 258.73,87.73 M2.D5 | v199.75,58.25 v122.9,58.25 IC2.S2 | v119.5,58.25 42.9,58.25 IC1.S2
  Bottom 0.305: v202.9,58.25 v199.75,58.25 | v122.9,58.25 v119.5,58.25
S3  (via drill 0.3)
  Top 0.305: M2.D4 256.19,86.69 228.5,59 v204.25,59 | v204.25,59 204.17,59 204.17,59.08 | IC3.S3 204.17,59.08 | 204.17,59.08 v204.25,59 | v200.5,59 v124.17,59 IC2.S3 | v120.5,59 44.17,59 IC1.S3
  Bottom 0.305: v204.25,59 v200.5,59 | v124.17,59 v120.5,59
SCL  (via drill 0.3)
  Top 0.305: v269,74 263.27,68.27 OLED.3
  Bottom 0.305: M2.A5 256.19,94.19 255,93 255,88 v269,74
SDA  (via drill 0.3)
  Top 0.305: v271,74 265.81,68.81 OLED.4
  Bottom 0.305: M2.A4 258.73,94.23 257.5,93 257.5,87.5 v271,74
VCC  (via drill 0.3)
  Top 0.406: R28.E R29.2 | R25.E R26.2 | R22.E R23.2 | R19.E R20.2 | R13.E R14.2 | R16.E R17.2 | R8.2 R7.E | R10.E R11.2 | R4.E R5.2 | R35.2 32,96 R34.E | R37.E R38.2 | R44.2 72,96 R43.E | R31.E R32.2 | R40.E R41.2 | R46.E R47.2 | R2.2 R1.E | R67.E R68.2 | R61.E R62.2 | R58.E R59.2 | R52.E R53.2 | R49.E R50.2 | R55.E R56.2 | R64.E R65.2 | R70.E R71.2 | R73.E R74.2 | R79.E R80.2 | R88.E R89.2 | R94.E R95.2 | R91.E R92.2 | R85.E R86.2 | R82.E R83.2 | R76.E R77.2 | R115.E R116.2 | R109.E R110.2 | R106.E R107.2 | R100.E R101.2 | R97.E R98.2 | R103.E R104.2 | R112.E R113.2 | R118.E R119.2 | R124.E R125.2 | R130.E R131.2 | R133.E R134.2 | R139.E R140.2 | R142.E R143.2 | R136.E R137.2 | R127.E R128.2 | R121.E R122.2 | IC1.VCC v28.5,60.75 C1.1 | IC3.VCC v188.5,60.75 C3.1 | IC2.VCC v108.5,60.75 C2.1 | OLED.2 260.77,66.54 C8.+ 268.9,79.13 SPI.6 268.9,85.65 270.12,86.88 270.12,109.75 268.75,111.12 250,111.12 248.57,109.69 M2.5V
  Bottom 0.406: OLED1.4 237,84
  Bottom 2.54: M2.5V arc-90 241.95,101 235,101
  pour Bottom: 3,-6 0,-6 0,-3 -3,-3 -3,117 237,117 237,-3 3,-3

### Text on the board
tPlace: GND | VIN | SERIAL | SPI